# Altium schematic sheet PAGE1 -  Schematic cove.SchDoc
size 386 x 246 mm
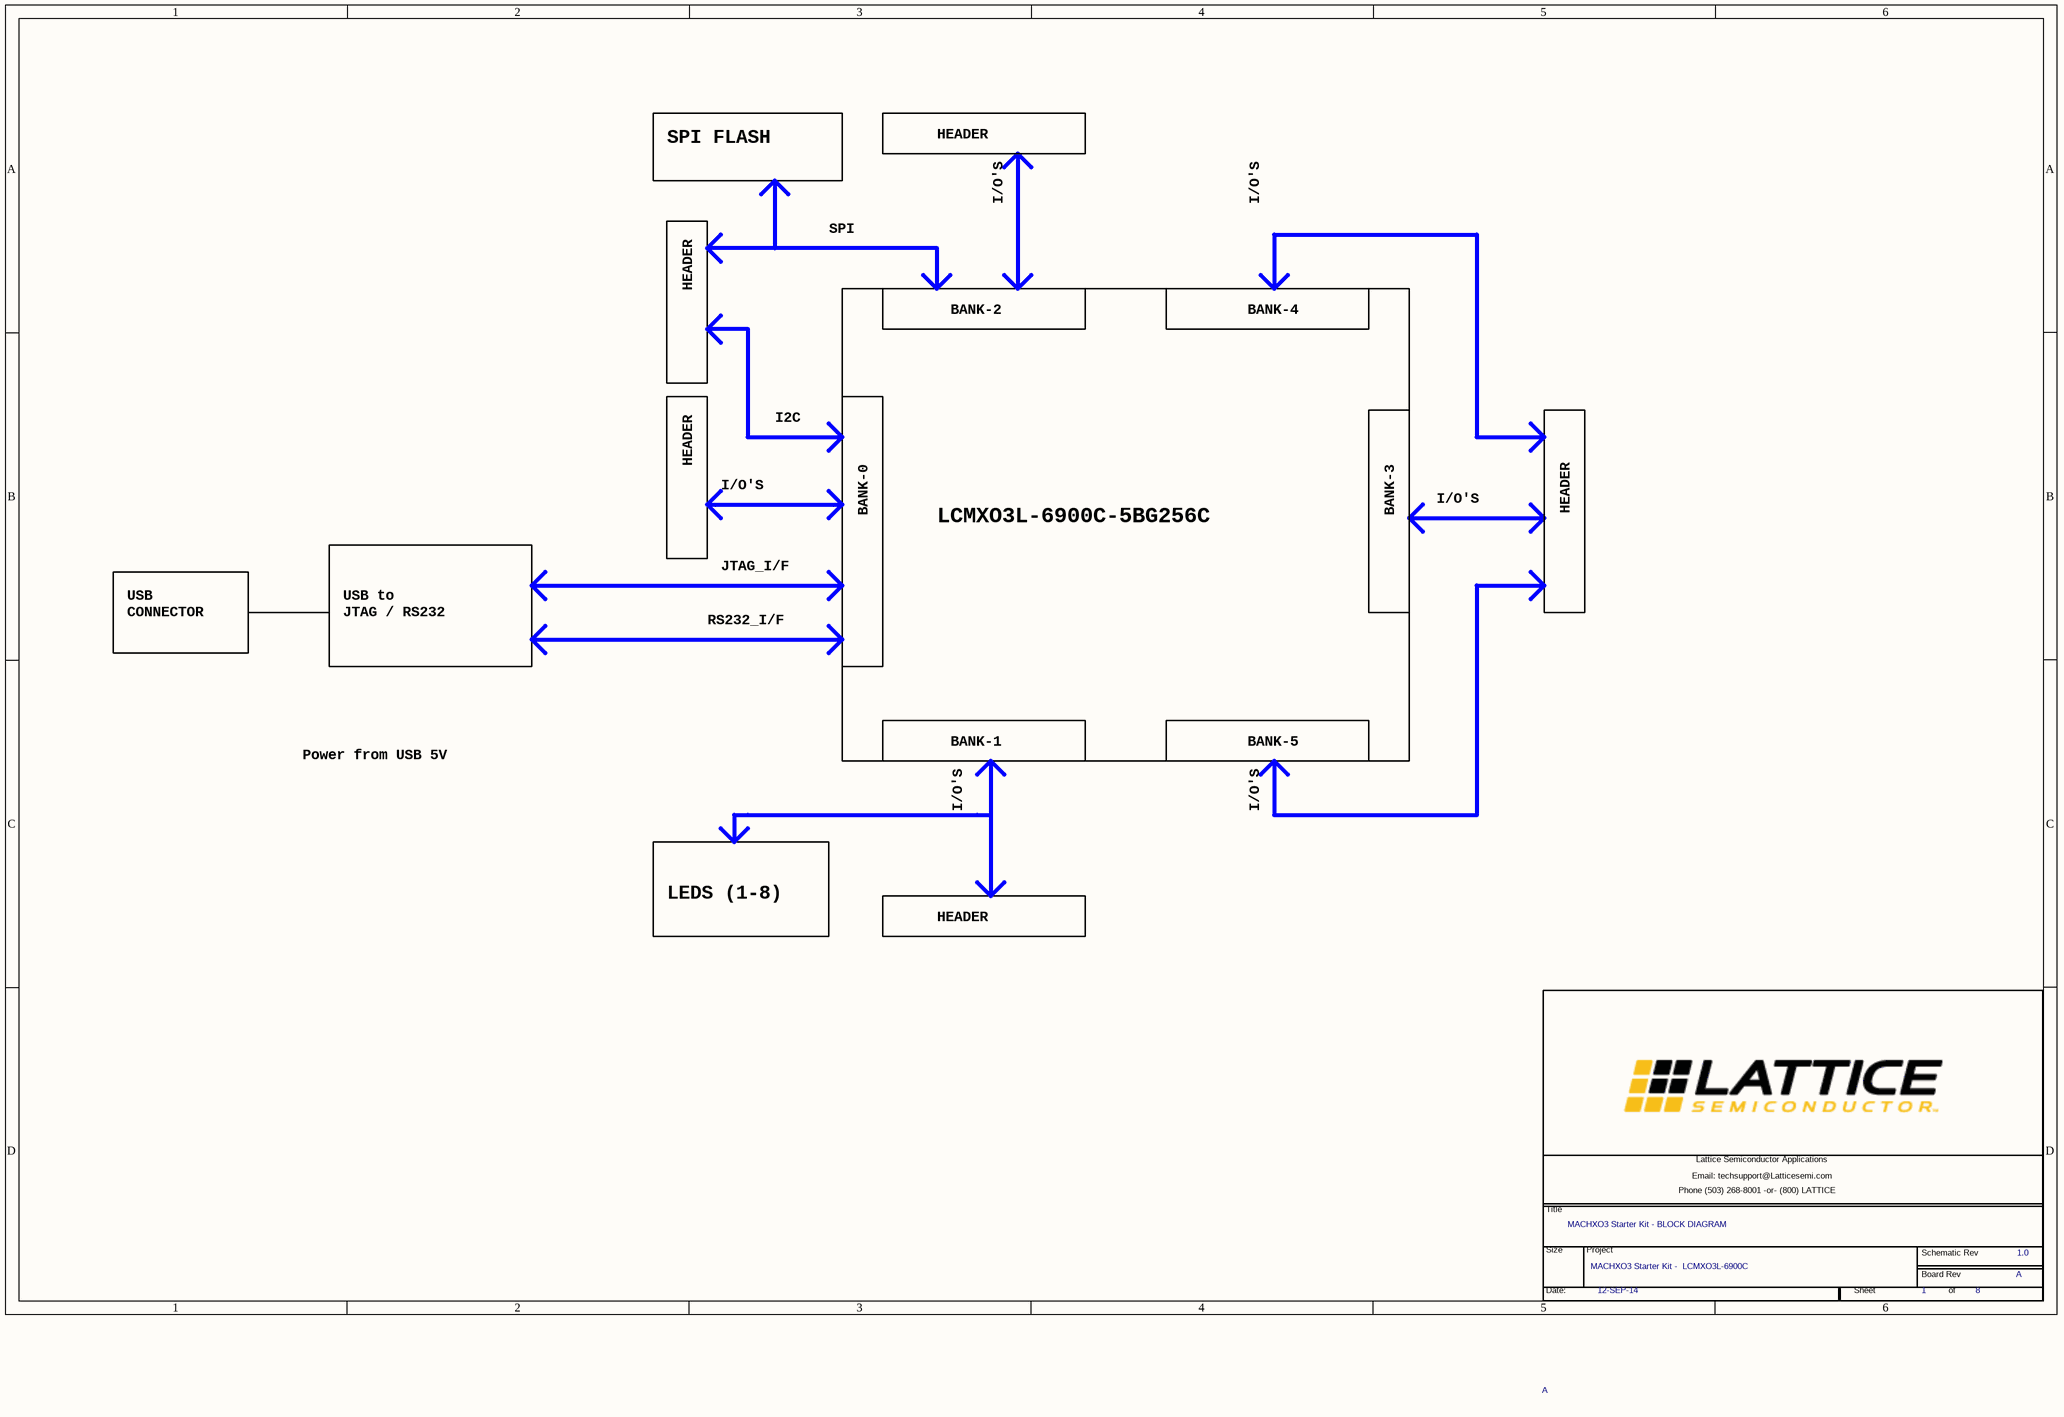
[diagram p0: PAGE1 -  Schematic cove.SchDoc]

## Parts
*  Project Name: MACHXO3 Starter Kit -  LCMXO3L-6900C  Title: MACHXO3 Starter Kit - BLOCK DIAGRAM  Page Number: 1  Page Count: 8  RevCode: 1.0  Page Size: A  Date:: 12-SEP-14  (hidden comment: Lattice Title Block New Brand)  (graphical)

## Notes on the sheet
- SPI FLASH
- HEADER
- SPI
- I/O'S
- BANK-2
- BANK-4
- I2C
- BANK-0
- LCMXO3L-6900C-5BG256C
- BANK-3
- USB
  CONNECTOR
- USB to
  JTAG / RS232
- JTAG_I/F
- RS232_I/F
- Power from USB 5V
- BANK-1
- BANK-5
- LEDS (1-8)
- (in symbol Lattice Title Block New Brand) Lattice Semiconductor Applications; Email: techsupport@Latticesemi.com; Phone (503) 268-8001 -or- (800) LATTICE; Title; Size; Project; Schematic Rev; Board Rev; Date:; Sheet; of

## Library data of the parts
* = Lattice Title Block New Brand: Board Rev: A